# Altium schematic sheet airPi_HV.schdoc
size 85 x 83 mm
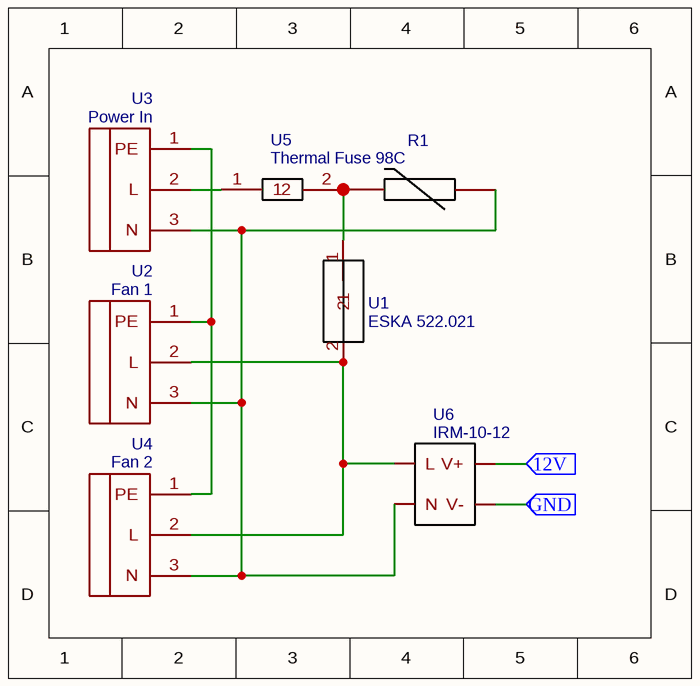
[diagram p0: airPi_HV.schdoc]

## Parts
R1  Varistor  [B72220S0301K101]  (value not drawn)
U1  ESKA 522.021  [ESKA 380]
U2  Fan 1  [CONN-TH_3P-P5.08_1757255]
U3  Power In  [CONN-TH_3P-P5.08_1757255]
U4  Fan 2  [CONN-TH_3P-P5.08_1757255]
U5  Thermal Fuse 98C  [THERMAL FUSE]
U6  IRM-10-12  [IRM-10-12]

## Ports
12V (in), GND (in)

## Nets
12V: U6.V+ ; port 12V
GND: U6.V- ; port GND
NetR1_1: R1.1 U2.3(N) U3.3(N) U4.3(N) U6.N
NetR1_2: R1.2 U1.1 U5.2
NetU1_2: U1.2 U2.2(L) U4.2(L) U6.L
NetU2_1: U2.1(PE) U3.1(PE) U4.1(PE)
NetU3_2: U3.2(L) U5.1

## Library data of the parts
R1 = Varistor: Manufacturer: EPCOS - TDK Electronics; Contributor: johncurtin; Package Display: No; Manufacturer Part: B72220S0301K101; Supplier: Digi-Key; Supplier Part: 495-6539-1-ND; link: https://www.digikey.com/en/products/detail/epcos-tdk-electronics/B72220S0301K101/651287?s=N4IgTCBcDaIEIHYzIAwGUUGYUEYDSOuIAugL5A; spicePre: R; spiceSymbolName: B72220S0301K551
U1 = ESKA 522.021: Manufacturer Part: 2050000172717; Contributor: Rhome; link: https://www.conrad.de/de/eska-380000-sicherungshalter-passend-fuer-flachsicherung-standard-20-a-32-vdc-1-st-534048.html#downloadcenter; spicePre: U; spiceSymbolName: ESKA 380
U2 = Fan 1: Manufacturer: Phoenix Contact(菲尼克斯); Manufacturer Part: MSTBA 2,5/ 3-G-5,08; Contributor: lcsc; Supplier: LCSC; Supplier Part: C5183941; JLCPCB Part Class: Extended Part; spicePre: U; spiceSymbolName: MSTBA 2,5/ 3-G-5,08
U3 = Power In: Manufacturer: Phoenix Contact(菲尼克斯); Manufacturer Part: MSTBA 2,5/ 3-G-5,08; Contributor: lcsc; Supplier: LCSC; Supplier Part: C5183941; JLCPCB Part Class: Extended Part; spicePre: U; spiceSymbolName: MSTBA 2,5/ 3-G-5,08
U4 = Fan 2: Manufacturer: Phoenix Contact(菲尼克斯); Manufacturer Part: MSTBA 2,5/ 3-G-5,08; Contributor: lcsc; Supplier: LCSC; Supplier Part: C5183941; JLCPCB Part Class: Extended Part; spicePre: U; spiceSymbolName: MSTBA 2,5/ 3-G-5,08
U5 = Thermal Fuse 98C: Manufacturer: ESKA; Manufacturer Part: 777.098; Contributor: ljeff; spicePre: U; spiceSymbolName: Thermal Fuse ESKA
U6 = IRM-10-12: Manufacturer: MEAN WELL USA Inc.; Contributor: energybank; Manufacturer Part: IRM-10-12; Supplier: Digi-Key; Supplier Part: 1866-3028-ND; link: https://www.meanwellusa.com/upload/pdf/IRM-10/IRM-10-spec.pdf; spicePre: U; spiceSymbolName: IRM-10-12